# EAGLE design ATMEGA32_DEV (EAGLE 9.6.0)
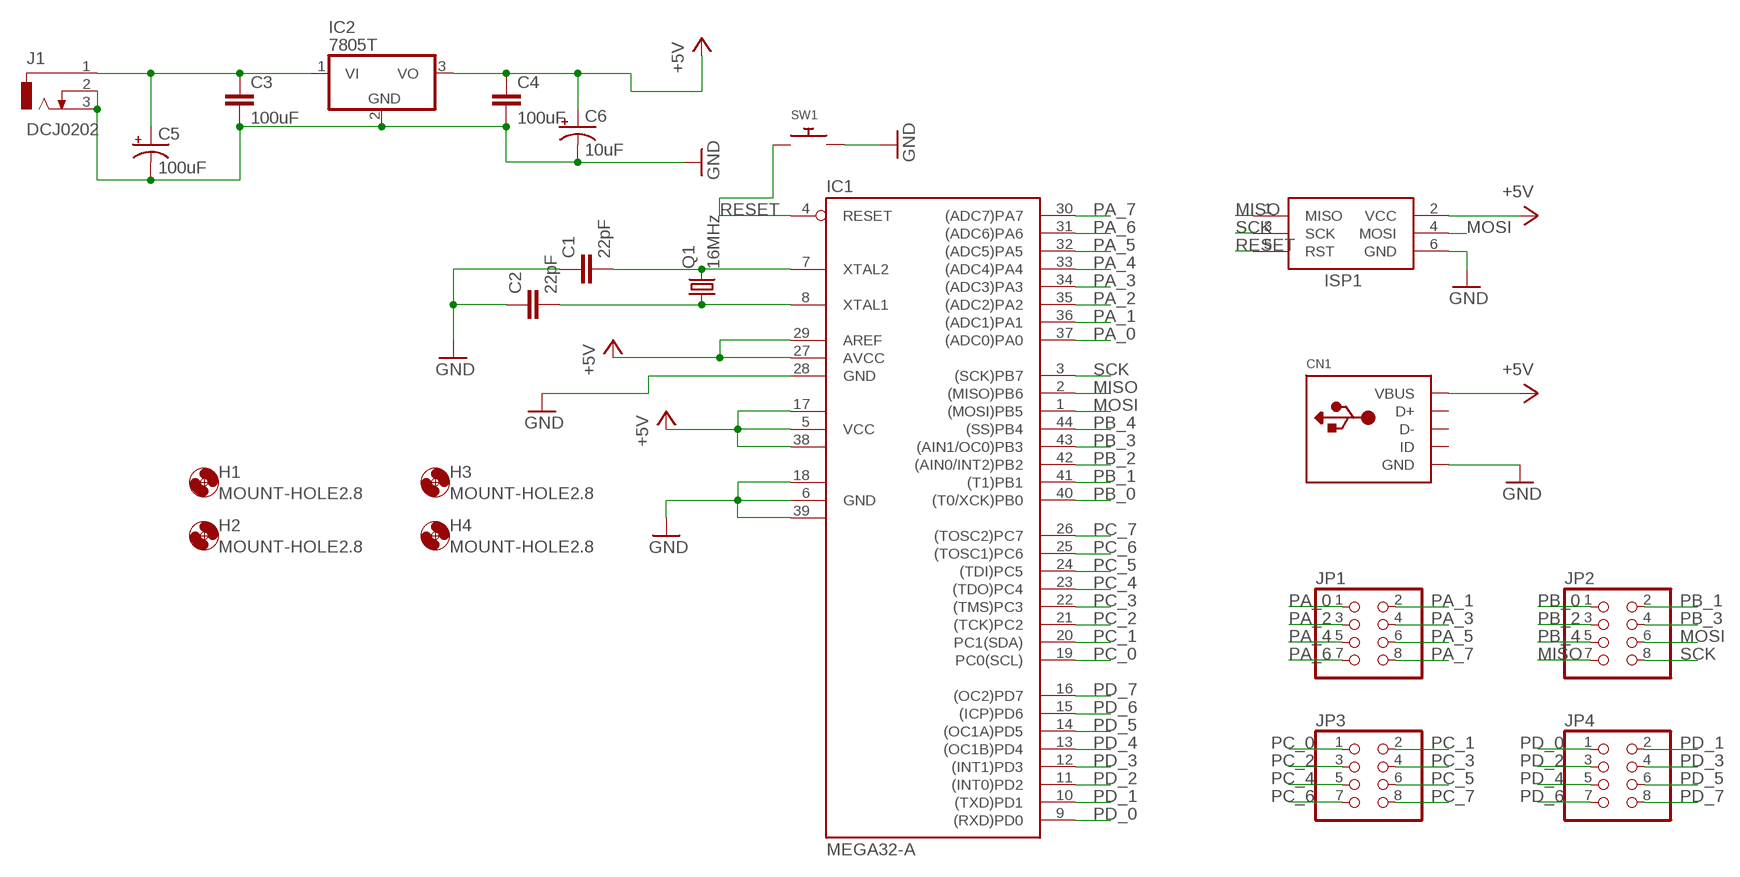
[diagram p0: schematic, sheet 1]

## Parts
C1  22pF  C-EUC0805  [C0805]
C2  22pF  C-EUC0805  [C0805]
C3  100uF  C-EUC0805  [C0805]
C4  100uF  C-EUC0805  [C0805]
C5  100uF  CPOL-USE5-8.5  [E5-8,5]
C6  10uF  CPOL-USE5-8.5  [E5-8,5]
CN1  USBMINIB  [USB-MINIB]
H1  MOUNT-HOLE2.8  [2,8]
H2  MOUNT-HOLE2.8  [2,8]
H3  MOUNT-HOLE2.8  [2,8]
H4  MOUNT-HOLE2.8  [2,8]
IC1  MEGA32-A  [TQFP44]
IC2  7805T  [TO220H]
ISP1  AVRISP-BOX  [AVRISP-BOX]
J1  DCJ0202  [DCJ0202]
JP1  PINHD-2X4  [2X04]
JP2  PINHD-2X4  [2X04]
JP3  PINHD-2X4  [2X04]
JP4  PINHD-2X4  [2X04]
Q1  16MHz  CRYSTALHC49S  [HC49/S]
SW1  SWITCH_PUSHBUTTONEVQ-PE  [TACT_PANA-EVQ]

## Nets
+5V: C4.1 C6.+ CN1.VBUS IC1.5(VCC) IC1.17(VCC1) IC1.27(AVCC) IC1.29(AREF) IC1.38(VCC2) IC2.3(VO) ISP1.2(VCC)
GND: C1.1 C2.1 C3.2 C4.2 C5.- C6.- CN1.GND IC1.6(GND) IC1.18(GND1) IC1.28(GND) IC1.39(GND2) IC2.2(GND) ISP1.6(GND) J1.2 J1.3 SW1.P$2
MISO: IC1.2((MISO)PB6) ISP1.1(MISO) JP2.7
MOSI: IC1.1((MOSI)PB5) ISP1.4(MOSI) JP2.6
N$1: C1.2 IC1.7(XTAL2) Q1.2
N$2: C2.2 IC1.8(XTAL1) Q1.1
N$3: C3.1 C5.+ IC2.1(VI) J1.1
PA_0: IC1.37((ADC0)PA0) JP1.1
PA_1: IC1.36((ADC1)PA1) JP1.2
PA_2: IC1.35((ADC2)PA2) JP1.3
PA_3: IC1.34((ADC3)PA3) JP1.4
PA_4: IC1.33((ADC4)PA4) JP1.5
PA_5: IC1.32((ADC5)PA5) JP1.6
PA_6: IC1.31((ADC6)PA6) JP1.7
PA_7: IC1.30((ADC7)PA7) JP1.8
PB_0: IC1.40((T0/XCK)PB0) JP2.1
PB_1: IC1.41((T1)PB1) JP2.2
PB_2: IC1.42((AIN0/INT2)PB2) JP2.3
PB_3: IC1.43((AIN1/OC0)PB3) JP2.4
PB_4: IC1.44((SS)PB4) JP2.5
PC_0: IC1.19(PC0(SCL)) JP3.1
PC_1: IC1.20(PC1(SDA)) JP3.2
PC_2: IC1.21((TCK)PC2) JP3.3
PC_3: IC1.22((TMS)PC3) JP3.4
PC_4: IC1.23((TDO)PC4) JP3.5
PC_5: IC1.24((TDI)PC5) JP3.6
PC_6: IC1.25((TOSC1)PC6) JP3.7
PC_7: IC1.26((TOSC2)PC7) JP3.8
PD_0: IC1.9((RXD)PD0) JP4.1
PD_1: IC1.10((TXD)PD1) JP4.2
PD_2: IC1.11((INT0)PD2) JP4.3
PD_3: IC1.12((INT1)PD3) JP4.4
PD_4: IC1.13((OC1B)PD4) JP4.5
PD_5: IC1.14((OC1A)PD5) JP4.6
PD_6: IC1.15((ICP)PD6) JP4.7
PD_7: IC1.16((OC2)PD7) JP4.8
RESET: IC1.4(RESET) ISP1.5(RST) SW1.P$1
SCK: IC1.3((SCK)PB7) ISP1.3(SCK) JP2.8
Unconnected: CN1.D+ CN1.D- CN1.ID

## Library data of the parts
C1-C4 = rcl:C-EU: CAPACITOR, European symbol; SPICEPREFIX: C
C5 C6 = rcl:CPOL-US: POLARIZED CAPACITOR, American symbol; SPICEPREFIX: C
CN1 = adafruit:USB: USB Connectors USBMINIB - Surface Mount Female Mini-B USB Connector 4UConnector: 06564 By microbuilder.eu Thru-hole RA Female Mini-B USB Connector 4UConnector: 18732 By ladyada.net
H1-H4 = holes:MOUNT-HOLE: MOUNTING HOLE with drill center marker
IC1 = atmel:MEGA32: MICROCONTROLLER 32 Kbytes FLASH 2 Kbytes SRAM 1 Kbytes EEPROM USART 8-channel 10 bit ADC Source: www.atmel.com .. doc2503.pdf; MPN: ATMEGA32-16AU; OC_FARNELL: 9171274; OC_NEWARK: 69K6677
IC2 = linear:78*: Positive VOLTAGE REGULATOR Source: http://cache.national.com/ds/LM/LM78L05.pdf http://www.fairchildsemi.com/ds/LM/LM7805.pdf
ISP1 = adafruit:AVRISP: AVR ISP HEADER Standard 6 pin header for AVR programming
J1 = con-jack:DCJ0202: DC POWER JACK Source: DCJ0202.pdf; OC_FARNELL: unknown; OC_NEWARK: unknown
JP1-JP4 = adafruit:PINHD-2X4: PIN HEADER
Q1 = adafruit:CRYSTAL: CRYSTAL; OC_FARNELL: 1667008; OC_NEWARK: unknown
SW1 = adafruit:SWITCH_PUSHBUTTON: Buttons SOFTTOUCHSMD_SJ - Soft touch temporary push button (Super Junk Akihabara) Compatible with SKPMANE010 [Mouser: 688-SKPMAN] C&K_KSS = Digikey: KSS221GLFS

## Module GSM
Ports: 

### Library data of the parts

## Board
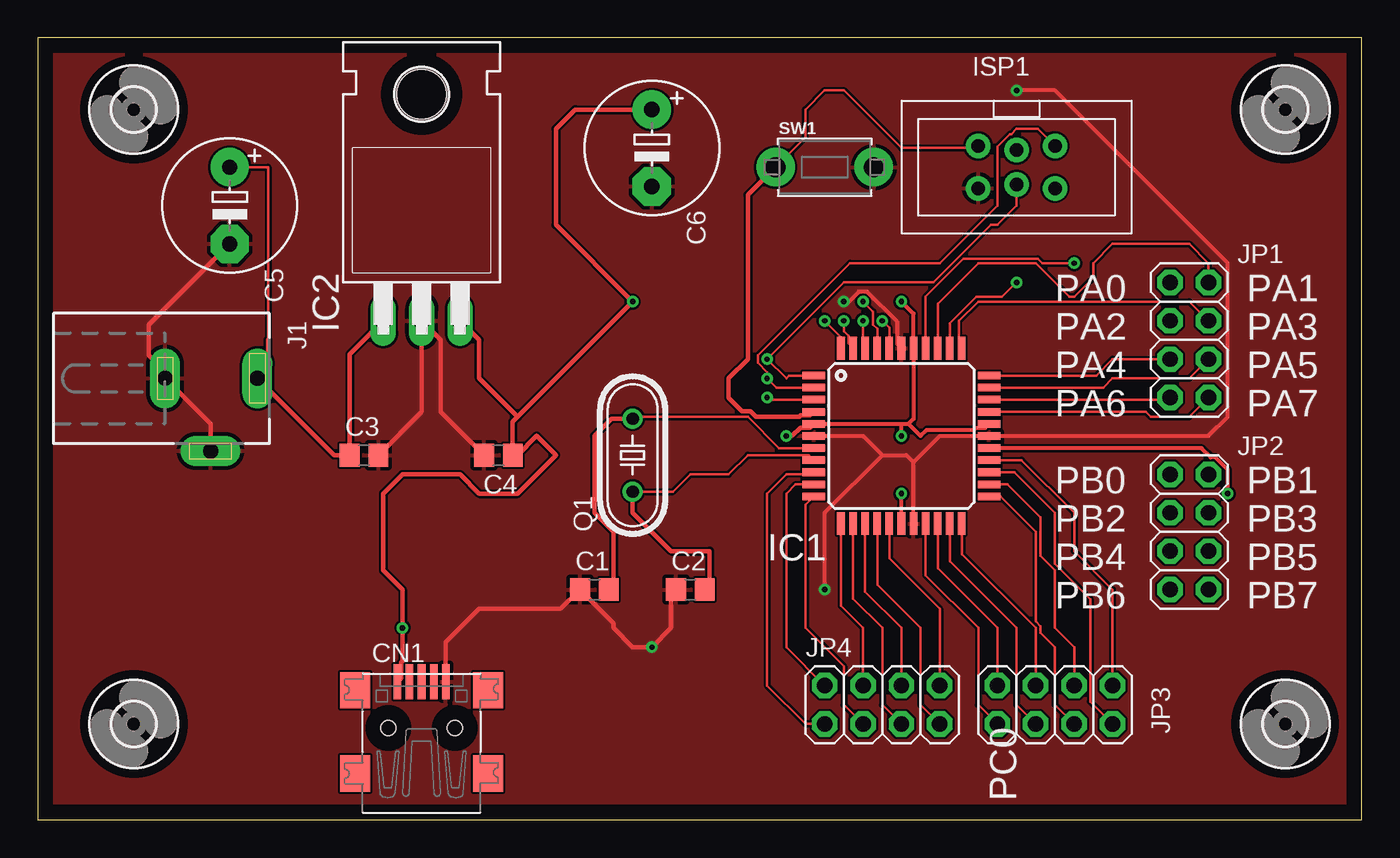
[diagram p1: board, top side]
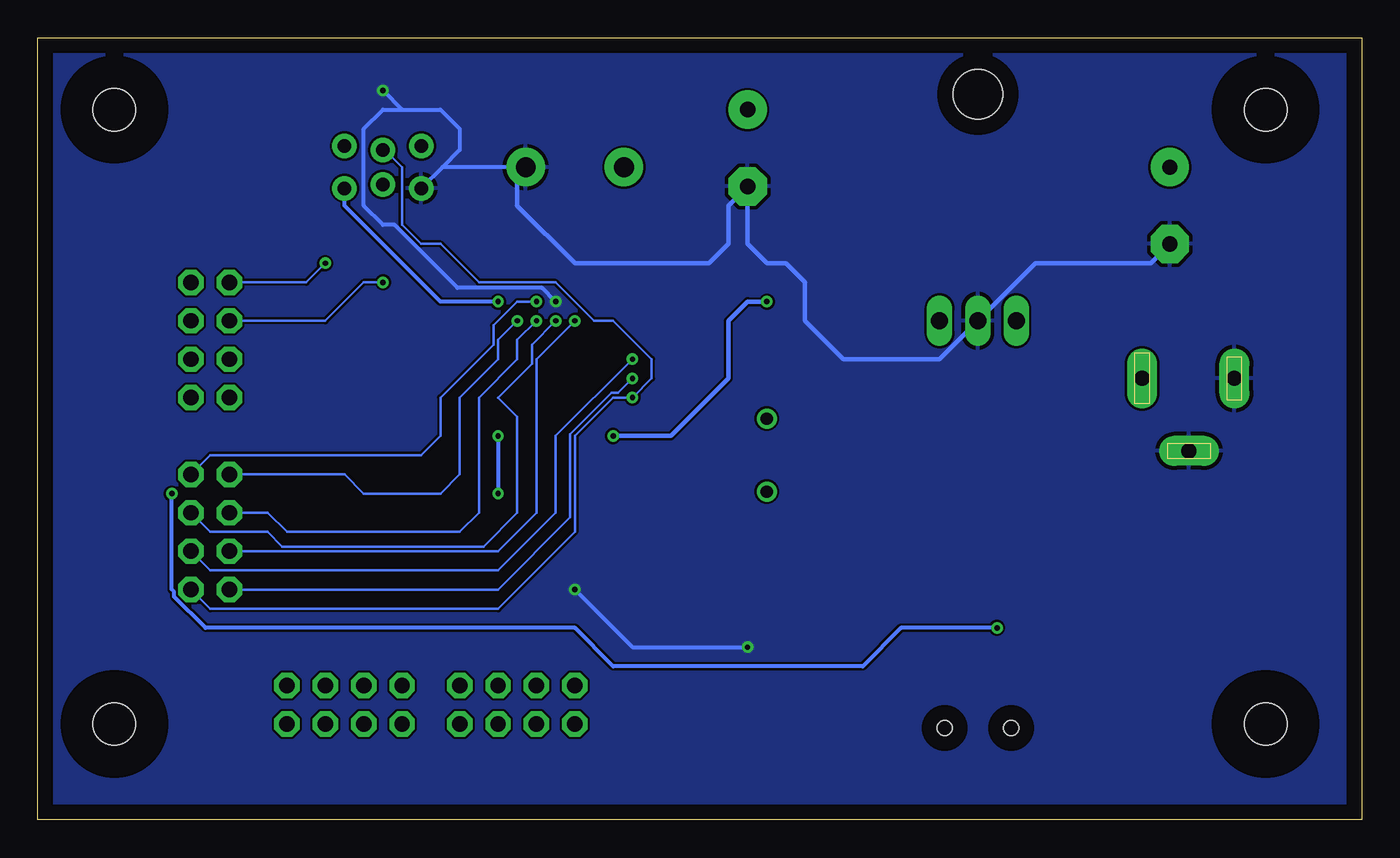
[diagram p2: board, bottom side, seen from below]

Size 87.61 x 51.74 mm. Coordinates in mm from the lower left corner, seen from the top.
Outline: 0,0 87.61,0 87.61,51.74 0,51.74 0,0
Copper layers (1*16): Top 0.035mm / dielectric 1.5mm / Bottom 0.035mm
Design rules "default": minimum track width 6mil, minimum drill 0.35mm, track to track 6mil, track to pad 6mil, pad to pad 6mil, via to via 6mil, smd to smd 6mil, copper to edge 40mil, drill to drill 6mil, minimum pad ring 10mil, minimum via ring 8mil, stop-mask expansion 4mil, vias tented up to drill 0mil, thermal gap 10mil

### Footprints (pad centres in the part's own frame; a part is rotated, then mirrored left to right if it is on the bottom)
C0805 = smd 1.3 x 1.5: 1 -0.95,0; 2 0.95,0
E5-8,5 = drill 1.016 pad 2.54: + -2.54,0 | drill 1.016 pad 2.54 octagon: - 2.54,0
USB-MINIB = smd 0.5 x 2.308: D+ 0,4.064; D- -0.8,4.064; GND 1.6,4.064; ID 0.8,4.064; VBUS -1.6,4.064 | smd 2 x 2.4: GND1 -4.4,-2; GND2 -4.4,3.5; GND3 4.4,3.5; GND4 4.4,-2 | hole 1: -2.2,1; 2.2,1
2,8 = hole 2.8: 0,0
TQFP44 = smd 1.5 x 0.5: 1 -5.8,4; 2 -5.8,3.2; 3 -5.8,2.4; 4 -5.8,1.6; 5 -5.8,0.8; 6 -5.8,0; 7 -5.8,-0.8; 8 -5.8,-1.6; 9 -5.8,-2.4; 10 -5.8,-3.2; 11 -5.8,-4; 23 5.8,-4; 24 5.8,-3.2; 25 5.8,-2.4; 26 5.8,-1.6; 27 5.8,-0.8; 28 5.8,0; 29 5.8,0.8; 30 5.8,1.6; 31 5.8,2.4; 32 5.8,3.2; 33 5.8,4 | smd 0.5 x 1.5: 12 -4,-5.8; 13 -3.2,-5.8; 14 -2.4,-5.8; 15 -1.6,-5.8; 16 -0.8,-5.8; 17 0,-5.8; 18 0.8,-5.8; 19 1.6,-5.8; 20 2.4,-5.8; 21 3.2,-5.8; 22 4,-5.8; 34 4,5.8; 35 3.2,5.8; 36 2.4,5.8; 37 1.6,5.8; 38 0.8,5.8; 39 0,5.8; 40 -0.8,5.8; 41 -1.6,5.8; 42 -2.4,5.8; 43 -3.2,5.8; 44 -4,5.8
TO220H = drill 1.118 long: 1 -2.54,-10.16; 2 0,-10.16; 3 2.54,-10.16 | hole 3.302: 0,4.826
AVRISP-BOX = drill 0.9 pad 1.626: 1 -1.397,2.54; 2 1.397,2.54; 3 -1.143,0; 4 1.143,0; 5 -1.397,-2.54; 6 1.397,-2.54
DCJ0202 = drill 1 pad 2 long: 1 0,3.1; 2 4.8,0; 3 0,-3
2X04 = drill 1.016 pad 1.676 octagon: 1 -3.81,-1.27; 2 -3.81,1.27; 3 -1.27,-1.27; 4 -1.27,1.27; 5 1.27,-1.27; 6 1.27,1.27; 7 3.81,-1.27; 8 3.81,1.27
HC49/S = drill 0.813: 1 -2.413,0; 2 2.413,0
TACT_PANA-EVQ = drill 1.3 pad 2.54: P$1 -3.25,0; P$2 3.25,0

### Placement (x,y rotation side)
C1  36.83,15.24 0 top
C2  43.18,15.24 0 top
C3  21.59,24.13 0 top
C4  30.48,24.13 180 top
C5  12.7,40.64 270 top
C6  40.64,44.45 270 top
CN1  25.4,5.08 0 top
H1  6.35,6.35 0 top
H2  6.35,46.99 0 top
H3  82.55,6.35 0 top
H4  82.55,46.99 0 top
IC1  57.15,25.4 0 top
IC2  25.4,43.18 0 top
ISP1  64.77,43.18 270 top
J1  11.43,29.21 270 top
JP1  76.2,31.75 270 top
JP2  76.2,19.05 270 top
JP3  67.31,7.62 0 top
JP4  55.88,7.62 0 top
Q1  39.37,24.13 90 top
SW1  52.07,43.18 0 top

### Tracks (layer width: path | path; a pad name or v marks a point on that pad's centre or on a via)
+5V  (via drill 0.35)
  Top 0.254: IC1.29 62.68,25.93 62.08,25.93 61.96,25.81 58.83,25.81 58.42,25.4 57.62,26.2 | IC1.5 57.15,26.2 | 57.15,26.2 57.62,26.2 | 57.62,26.2 57.95,26.53 IC1.38 57.95,33.49 v57.15,34.29 | IC1.17 v57.15,21.59 | v57.15,25.4 57.15,26.2 | IC1.27 77,24.6 77.62,23.98 77.93,23.98 78.74,23.17 v78.74,21.59
  Top 0.305: 31.75,24.45 C4.1 | C6.+ 35.56,46.99 34.29,45.72 34.29,39.37 v39.37,34.29 31.75,26.67 | CN1.VBUS 24.04,9.39 24.04,10.42 24.13,10.51 v24.13,12.7 24.13,15.24 22.86,16.51 22.86,21.59 24.13,22.86 27.94,22.86 29.21,21.59 31.75,21.59 34.29,24.13 33.02,25.4 31.75,24.13 C4.1 | IC1.5 51.11,25.96 50.47,25.96 49.92,25.4 v49.53,25.4 | 31.75,26.67 31.43,26.35 C4.1 | 31.75,26.67 29.21,29.21 29.21,31.75 IC2.3
  Bottom 0.254: ISP1.2 67.31,40.64 60.96,34.29 v57.15,34.29 | v57.15,25.4 v57.15,21.59 | v24.13,12.7 30.48,12.7 33.02,10.16 49.53,10.16 52.07,12.7 76.51,12.7 78.59,14.78 78.59,15.09 78.74,15.24 v78.74,21.59
  Bottom 0.305: v49.53,25.4 45.72,25.4 41.91,29.21 41.91,33.02 40.64,34.29 v39.37,34.29
GND  (via drill 0.35)
  Top 0.152: IC1.28 63.5,25.4
  Top 0.254: IC1.18 57.95,23.66 | 57.95,23.66 59.69,25.4 IC1.28 77.47,25.4 78.74,26.67 78.74,36.83 67.31,48.26 v64.77,48.26 | IC1.6 54.61,25.4 55.88,24.13 | 55.88,24.13 52.07,20.32 v52.07,15.24 | IC1.39 56.88,31.47 56.88,32.95 54.88,34.95 54.34,34.95 53.68,34.29 v53.34,34.29 | 55.88,24.13 57.48,24.13 57.95,23.66
  Top 0.305: C3.2 25.4,26.99 IC2.2 26.67,31.75 26.67,26.99 C4.2 | C5.- 7.35,32.75 7.35,30.75 8.89,29.21 J1.3 11.43,26.21 J1.2 11.43,24.13 | CN1.GND 27,11.76 29.21,13.97 34.61,13.97 C1.1 38.1,13.02 38.1,12.7 39.37,11.43 v40.64,11.43 41.91,12.7 41.91,15.24 C2.1
  Bottom 0.254: SW1.P$2 60.83,43.18 | 60.83,43.18 ISP1.6 | v40.64,11.43 48.26,11.43 v52.07,15.24 | v53.34,34.29 54.25,35.2 59.84,35.2 64,39.37 64.77,39.37 66.04,40.64 66.04,45.72 64.77,46.99 63.5,46.99 | 60.83,43.18 59.69,44.32 59.69,45.72 60.96,46.99 63.5,46.99 | v64.77,48.26 63.5,46.99
  Bottom 0.305: C5.- 13.97,36.83 21.59,36.83 IC2.2 27.94,30.48 34.29,30.48 36.83,33.02 36.83,35.56 38.1,36.83 39.37,36.83 40.64,38.1 C6.- 41.91,40.64 41.91,38.1 43.18,36.83 52.07,36.83 55.88,40.64 55.88,42.62 SW1.P$2
  pour Top: -3.81,54.61 90.17,54.61 90.17,-3.81 -3.81,-3.81
  pour Bottom: -3.81,54.61 90.17,54.61 90.17,-3.81 -3.81,-3.81
MISO  (via drill 0.35)
  Top 0.152: IC1.2 48.87,28.6 v48.26,29.21 48.26,29.62 47.65,30.23 47.65,30.73 53.75,36.83 59.69,36.83 63.5,40.64 63.5,44.53 64.34,45.36 64.41,45.36 64.77,45.72 66.17,45.72 ISP1.1
  Bottom 0.152: v48.26,29.21 49.23,28.25 49.66,28.25 52.38,25.53 52.38,20.01 57.15,15.24 JP2.7
MOSI  (via drill 0.35)
  Top 0.152: IC1.1 49.72,29.4 49.53,29.21 v48.26,30.48 53.34,35.56 59.26,35.56 63.07,39.37 63.5,39.37 64.77,40.64 ISP1.4
  Bottom 0.152: v48.26,30.48 53.34,25.4 53.34,20.32 57.15,16.51 76.2,16.51 JP2.6
N$1
  Top 0.152: Q1.2 39.5,26.67 46.99,26.67 49.06,24.6 IC1.7
  Top 0.305: Q1.2 37.97,26.54 36.83,25.4 36.83,20.32 38.1,19.05 38.1,15.56 C1.2
N$2
  Top 0.152: Q1.1 42.04,21.72 43.18,22.86 45.72,22.86 46.99,24.13 50.5,24.13 50.51,24.12 51.03,24.12 IC1.8
  Top 0.305: Q1.1 39.37,20.32 41.91,17.78 44.45,17.78 44.45,15.56 C2.2
N$3
  Top 0.152: C5.+ 15.24,43.18 15.24,31.75 15.24,30.85
  Top 0.305: IC2.1 20.64,30.8 C3.1 19.61,24.13 J1.1 15.24,29.92 15.24,31.75
PA_0  (via drill 0.35)
  Top 0.152: IC1.37 58.75,34.62 61.27,37.14 66.17,37.14 66.47,36.83 v68.58,36.83
  Bottom 0.152: v68.58,36.83 69.85,35.56 JP1.1
PA_1
  Top 0.152: IC1.36 59.55,34.15 62.23,36.83 66.04,36.83 68.28,34.59 68.58,34.59 69.85,35.86 69.85,36.83 71.12,38.1 76.2,38.1 77.47,36.83 JP1.2
PA_2  (via drill 0.35)
  Top 0.152: IC1.35 60.35,32.84 62.1,34.59 63.81,34.59 v64.77,35.56
  Bottom 0.152: v64.77,35.56 66.04,35.56 68.58,33.02 JP1.3
PA_3
  Top 0.152: IC1.34 60.96,31.39 60.96,33.02 62.23,34.29 76.2,34.29 JP1.4
PA_4
  Top 0.152: IC1.33 70.04,29.4 71.12,30.48 JP1.5
PA_5
  Top 0.152: IC1.32 70.51,28.6 71.12,29.21 76.2,29.21 JP1.6
PA_6
  Top 0.152: IC1.31 74.79,27.8 JP1.7
PA_7
  Top 0.152: IC1.30 73.33,27 73.66,26.67 76.2,26.67 JP1.8
PB_0  (via drill 0.35)
  Top 0.152: IC1.40 56.35,32.55 v55.88,33.02
  Bottom 0.152: v55.88,33.02 57.15,31.75 57.15,30.48 59.69,27.94 59.69,22.86 60.96,21.59 66.04,21.59 67.31,22.86 JP2.1
PB_1  (via drill 0.35)
  Top 0.152: IC1.41 55.55,32.49 55.27,32.77 55.27,33.63 v54.61,34.29
  Bottom 0.152: v54.61,34.29 55.88,34.29 57.45,32.72 57.45,31.44 60.96,27.94 60.96,25.4 62.23,24.13 76.2,24.13 JP2.2
PB_2  (via drill 0.35)
  Top 0.152: IC1.42 54.61,31.34 v54.61,33.02
  Bottom 0.152: v54.61,33.02 55.88,31.75 55.88,30.48 58.42,27.94 58.42,20.32 59.69,19.05 71.12,19.05 72.39,20.32 JP2.3
PB_3  (via drill 0.35)
  Top 0.152: IC1.43 53.63,31.52 53.63,32.05 53.34,32.33 v53.34,33.02
  Bottom 0.152: v53.34,33.02 54.92,31.44 54.92,30.18 57.15,27.94 55.88,26.67 55.88,20.32 58.12,18.08 71.42,18.08 72.39,19.05 76.2,19.05 JP2.4
PB_4  (via drill 0.35)
  Top 0.152: IC1.44 53.15,31.94 v52.07,33.02
  Bottom 0.152: v52.07,33.02 54.61,30.48 54.61,20.32 57.15,17.78 JP2.5
PC_0
  Top 0.152: IC1.19 58.75,16.18 62.23,12.7 62.23,7.62 JP3.1
PC_1
  Top 0.152: IC1.20 59.55,16.65 63.5,12.7 JP3.2
PC_2
  Top 0.152: IC1.21 60.35,17.12 64.77,12.7 64.77,7.62 JP3.3
PC_3
  Top 0.152: IC1.22 61.15,17.59 66.04,12.7 JP3.4
PC_4
  Top 0.152: IC1.23 63.69,21.4 66.04,19.05 66.04,13.13 66.34,12.83 66.34,12.39 67.31,11.43 67.31,7.62 JP3.5
PC_5
  Top 0.152: IC1.24 64.16,22.2 66.34,20.01 66.34,17.47 67.31,16.51 67.31,12.7 68.58,11.43 JP3.6
PC_6
  Top 0.152: IC1.25 64.63,23 67.31,20.32 67.31,16.94 69.65,14.6 69.65,7.82 JP3.7
PC_7
  Top 0.152: IC1.26 65.1,23.8 68.58,20.32 68.58,17.78 71.12,15.24 JP3.8
PD_0
  Top 0.152: IC1.9 51.21,22.86 49.53,22.86 48.26,21.59 48.26,8.89 50.8,6.35 JP4.1
PD_1
  Top 0.152: JP4.2 49.53,11.43 49.53,21.59 50.14,22.2 IC1.10
PD_2
  Top 0.152: IC1.11 50.8,20.85 50.8,12.7 53.34,10.16 53.34,7.62 JP4.3
PD_3
  Top 0.152: IC1.12 53.15,14.16 54.61,12.7 JP4.4
PD_4
  Top 0.152: IC1.13 53.95,14.63 55.88,12.7 55.88,7.62 JP4.5
PD_5
  Top 0.152: IC1.14 54.75,15.1 57.15,12.7 JP4.6
PD_6
  Top 0.152: IC1.15 55.55,15.57 58.42,12.7 58.42,7.62 JP4.7
PD_7
  Top 0.152: IC1.16 56.35,17.31 59.69,13.97 JP4.8
RESET
  Top 0.152: SW1.P$1 50.8,45.16 50.8,46.99 52.07,48.26 53.34,48.26 57.15,44.45 62.1,44.45 ISP1.5
  Top 0.305: SW1.P$1 46.99,41.35 46.99,30.48 45.72,29.21 45.72,27.94 46.61,27.05 47.15,27.05 47.53,26.67 50.39,26.67 50.47,26.75 51.11,26.75 IC1.4
SCK  (via drill 0.35)
  Top 0.152: IC1.3 48.4,27.8 v48.26,27.94
  Bottom 0.152: JP2.8 76.2,13.97 57.15,13.97 52.07,19.05 52.07,25.4 49.53,27.94 v48.26,27.94 46.99,29.21 46.99,30.48 49.53,33.02 50.8,33.02 53.34,35.56 58.42,35.56 60.96,38.1 62.23,38.1 63.5,39.37 63.5,43.18 64.64,44.32 ISP1.3

### Text on the board
tSilk: PA0 | PA1 | PA2 | PA3 | PA4 | PA5 | PA6 | PA7 | PB0 | PB1 | PB2 | PB3 | PB4 | PB5 | PB6 | PB7 | PC0